# Altium schematic sheet TMS5701224 Interfaces.SchDoc: TMS5701224 R4F MCU Interfaces
size Tabloid; SheetNumber: 17; SheetTotal: 18
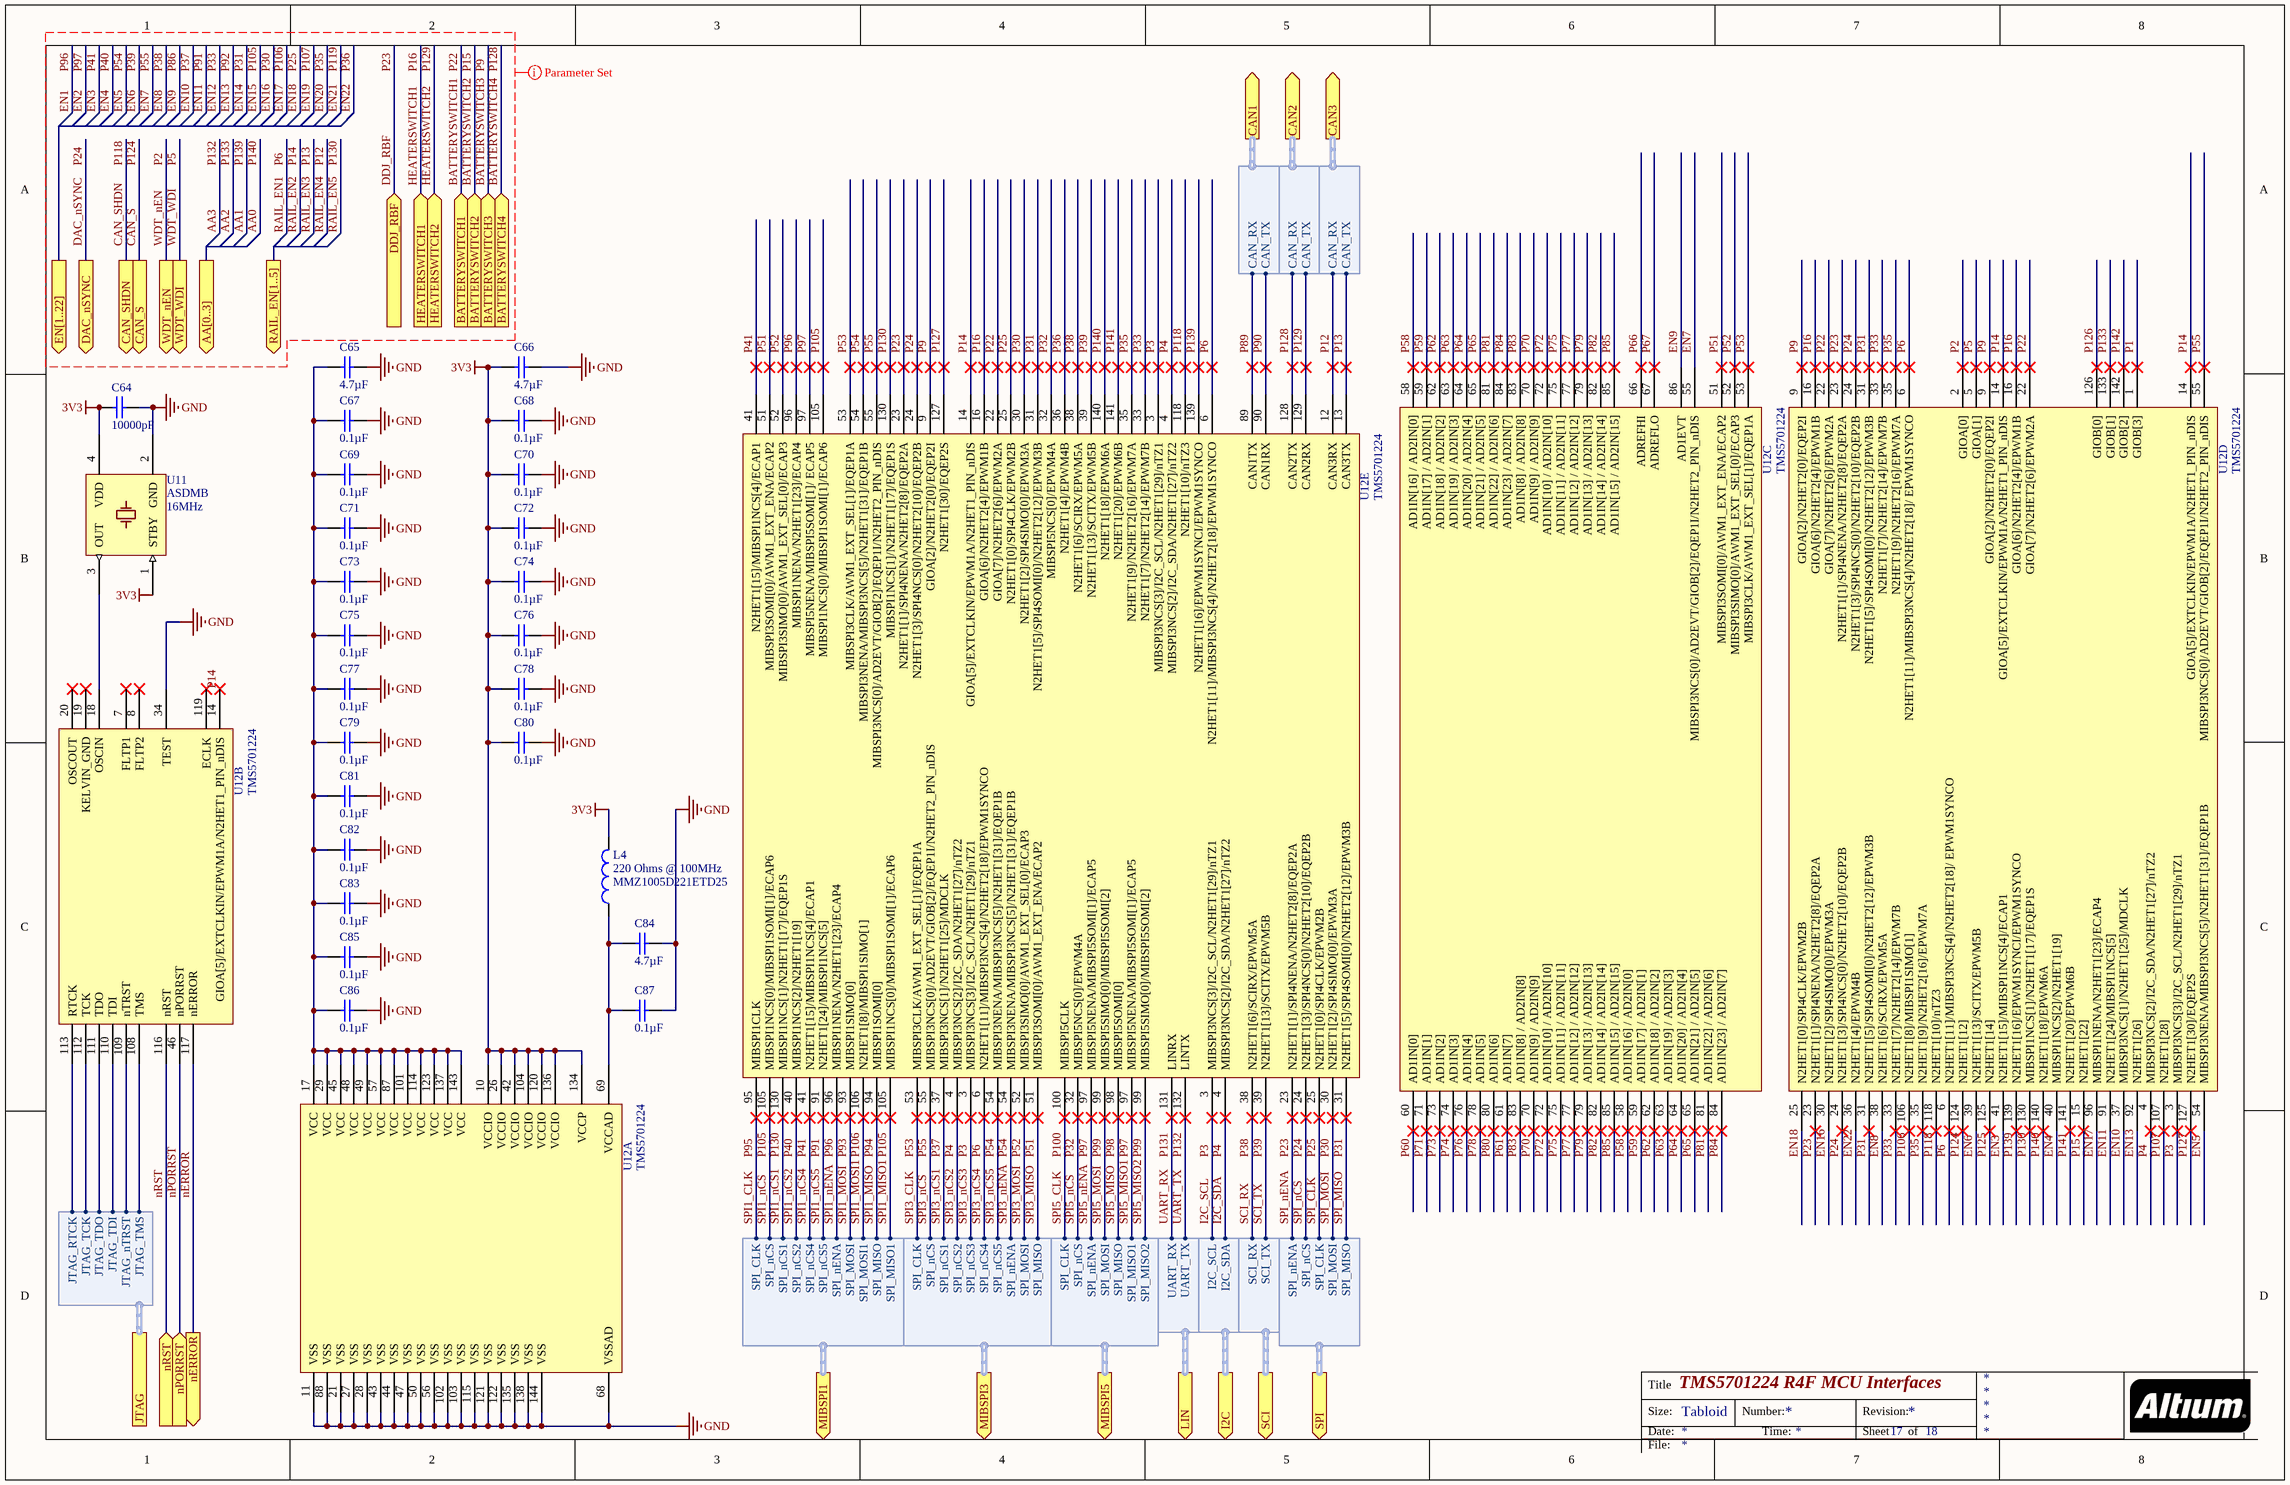
[diagram p0: TMS5701224 Interfaces.SchDoc]

## Parts
C64  value 10000pF  [TDK-CGA2B]  (hidden comment: Cap)
C65  value 4.7µF  [TDK-CGA4J]  (hidden comment: Cap)
C66  value 4.7µF  [TDK-CGA4J]  (hidden comment: Cap)
C67  value 0.1µF  [TDK-CGA2B]  (hidden comment: Cap)
C68  value 0.1µF  [TDK-CGA2B]  (hidden comment: Cap)
C69  value 0.1µF  [TDK-CGA2B]  (hidden comment: Cap)
C70  value 0.1µF  [TDK-CGA2B]  (hidden comment: Cap)
C71  value 0.1µF  [TDK-CGA2B]  (hidden comment: Cap)
C72  value 0.1µF  [TDK-CGA2B]  (hidden comment: Cap)
C73  value 0.1µF  [TDK-CGA2B]  (hidden comment: Cap)
C74  value 0.1µF  [TDK-CGA2B]  (hidden comment: Cap)
C75  value 0.1µF  [TDK-CGA2B]  (hidden comment: Cap)
C76  value 0.1µF  [TDK-CGA2B]  (hidden comment: Cap)
C77  value 0.1µF  [TDK-CGA2B]  (hidden comment: Cap)
C78  value 0.1µF  [TDK-CGA2B]  (hidden comment: Cap)
C79  value 0.1µF  [TDK-CGA2B]  (hidden comment: Cap)
C80  value 0.1µF  [TDK-CGA2B]  (hidden comment: Cap)
C81  value 0.1µF  [TDK-CGA2B]  (hidden comment: Cap)
C82  value 0.1µF  [TDK-CGA2B]  (hidden comment: Cap)
C83  value 0.1µF  [TDK-CGA2B]  (hidden comment: Cap)
C84  value 4.7µF  [TDK-CGA4J]  (hidden comment: Cap)
C85  value 0.1µF  [TDK-CGA2B]  (hidden comment: Cap)
C86  value 0.1µF  [TDK-CGA2B]  (hidden comment: Cap)
C87  value 0.1µF  [TDK-CGA2B]  (hidden comment: Cap)
L4  value 220 Ohms @ 100MHz  Manufacturer Part Number: MMZ1005D221ETD25  [TDK-MMZ1005]  (hidden comment: Inductor)
U11  ASDMB  value 16MHz  [ABR-ASDMB]
U12  TMS5701224  [TI-S-PQFP-G144]  (parts A,B,C,D,E of 5)

## Ports
AA[0..3] (out), BATTERYSWITCH1 (in), BATTERYSWITCH2 (in), BATTERYSWITCH3 (in), BATTERYSWITCH4 (in), CAN1 (out, harness TMS570_CAN1), CAN2 (out, harness TMS570_CAN2), CAN3 (out, harness TMS570_CAN3), CAN_S (out), CAN_SHDN (out), DAC_nSYNC (out), DDJ_RBF (in), EN[1..22] (out), HEATERSWITCH1 (in), HEATERSWITCH2 (in), I2C (out, harness TMS570_I2C), JTAG (harness TMS570_JTAG), LIN (out, harness TMS570_LIN), MIBSPI1 (out, harness TMS570_MIBSPI1), MIBSPI3 (out, harness TMS570_MIBSPI3), MIBSPI5 (out, harness TMS570_MIBSPI5), nERROR (out), nPORRST (in), nRST (in), RAIL_EN[1..5] (out), SCI (out, harness TMS570_SCI), SPI (out, harness TMS570_SPI), WDT_nEN (out), WDT_WDI (out)

## Harnesses
TMS570_MIBSPI1: SPI_CLK, SPI_nCS, SPI_nCS1, SPI_nCS2, SPI_nCS4, SPI_nCS5, SPI_nENA, SPI_MOSI, SPI_MOSI1, SPI_MISO, SPI_MISO1
TMS570_MIBSPI3: SPI_CLK, SPI_nCS, SPI_nCS1, SPI_nCS2, SPI_nCS3, SPI_nCS4, SPI_nCS5, SPI_nENA, SPI_MOSI, SPI_MISO
TMS570_MIBSPI5: SPI_CLK, SPI_nCS, SPI_nENA, SPI_MOSI, SPI_MISO, SPI_MISO1, SPI_MISO2
TMS570_LIN: UART_RX, UART_TX
TMS570_I2C: I2C_SCL, I2C_SDA
TMS570_SCI: SCI_RX, SCI_TX
TMS570_SPI: SPI_nENA, SPI_nCS, SPI_CLK, SPI_MOSI, SPI_MISO
TMS570_CAN2: CAN_RX, CAN_TX
TMS570_CAN3: CAN_RX, CAN_TX
TMS570_CAN1: CAN_RX, CAN_TX
TMS570_JTAG: JTAG_TMS, JTAG_TCK, JTAG_TDO, JTAG_TDI, JTAG_nTRST, JTAG_RTCK

## Nets
3V3: C64.2 C66.2 C68.2 C70.2 C72.2 C74.2 C76.2 C78.2 C80.2 L4.1 U11.1(STBY) U11.4(VDD) U12.10(VCCIO) U12.26(VCCIO) U12.42(VCCIO) U12.104(VCCIO) U12.120(VCCIO) U12.134(VCCP) U12.136(VCCIO)
GND: C64.1 C65.1 C66.1 C67.1 C68.1 C69.1 C70.1 C71.1 C72.1 C73.1 C74.1 C75.1 C76.1 C77.1 C78.1 C79.1 C80.1 C81.1 C82.1 C83.1 C84.1 C85.1 C86.1 C87.1 U11.2(GND) U12.11(VSS) U12.21(VSS) U12.27(VSS) U12.28(VSS) U12.34(TEST) U12.43(VSS) U12.44(VSS) U12.47(VSS) U12.50(VSS) U12.56(VSS) U12.68(VSSAD) U12.88(VSS) U12.102(VSS) U12.103(VSS) U12.115(VSS) U12.121(VSS) U12.122(VSS) U12.135(VSS) U12.138(VSS) U12.144(VSS)
AA0: U12.140(N2HET1[18]/EPWM6A)  [also labelled P140]
AA1: U12.139(N2HET1[16]/EPWM1SYNCI/EPWM1SYNCO)  [also labelled P139]
AA2: U12.133(GIOB[1])  [also labelled P133]
AA3: U12.132(LINTX) ; port LIN.UART_TX  [also labelled P132, UART_TX]
BATTERYSWITCH1: U12.22(GIOA[7]/N2HET2[6]/EPWM2A) ; port BATTERYSWITCH1  [also labelled P22]
BATTERYSWITCH2: U12.15(N2HET1[22]) ; port BATTERYSWITCH2  [also labelled P15]
BATTERYSWITCH3: U12.9(GIOA[2]/N2HET2[0]/EQEP2I) ; port BATTERYSWITCH3  [also labelled P9]
BATTERYSWITCH4: U12.128(CAN2TX) ; port BATTERYSWITCH4, port CAN2.CAN_RX  [also labelled P128]
CAN_S: U12.124(N2HET1[12]) ; port CAN_S  [also labelled P124]
CAN_SHDN: U12.118(N2HET1[10]/nTZ3) ; port CAN_SHDN  [also labelled P118]
DAC_nSYNC: U12.24(N2HET1[3]/SPI4NCS[0]/N2HET2[10]/EQEP2B) ; port DAC_nSYNC, port SPI.SPI_nCS  [also labelled P24, SPI_nCS]
DDJ_RBF: U12.23(N2HET1[1]/SPI4NENA/N2HET2[8]/EQEP2A) ; port DDJ_RBF, port SPI.SPI_nENA  [also labelled P23, SPI_nENA]
EN1: U12.96(MIBSPI1NENA/N2HET1[23]/ECAP4) ; port MIBSPI1.SPI_nENA  [also labelled P96, SPI1_nENA]
EN2: U12.97(MIBSPI5NENA/MIBSPI5SOMI[1]/_ECAP5) ; port MIBSPI5.SPI_nENA, port MIBSPI5.SPI_MISO1  [also labelled P97, SPI5_MISO1, SPI5_nENA]
EN3: U12.41(N2HET1[15]/MIBSPI1NCS[4]/ECAP1) ; port MIBSPI1.SPI_nCS4  [also labelled P41, SPI1_nCS4]
EN4: U12.40(MIBSPI1NCS[2]/N2HET1[19]) ; port MIBSPI1.SPI_nCS2  [also labelled P40, SPI1_nCS2]
EN5: U12.54(MIBSPI3NENA/MIBSPI3NCS[5]/N2HET1[31]/EQEP1B) ; port MIBSPI3.SPI_nCS5, port MIBSPI3.SPI_nENA  [also labelled P54, SPI3_nCS5, SPI3_nENA]
EN6: U12.39(N2HET1[13]/SCITX/EPWM5B) ; port SCI.SCI_TX  [also labelled P39, SCI_TX]
EN7: U12.55(MIBSPI3NCS[0]/AD2EVT/GIOB[2]/EQEP1I/N2HET2_PIN_nDIS) ; port MIBSPI3.SPI_nCS  [also labelled P55, SPI3_nCS]
EN8: U12.38(N2HET1[6]/SCIRX/EPWM5A) ; port SCI.SCI_RX  [also labelled P38, SCI_RX]
EN9: U12.86(AD1EVT)  [also labelled P86]
EN10: U12.37(MIBSPI3NCS[1]/N2HET1[25]/MDCLK) ; port MIBSPI3.SPI_nCS1  [also labelled P37, SPI3_nCS1]
EN11: U12.91(N2HET1[24]/MIBSPI1NCS[5]) ; port MIBSPI1.SPI_nCS5  [also labelled P91, SPI1_nCS5]
EN12: U12.33(N2HET1[7]/N2HET2[14]/EPWM7B)  [also labelled P33]
EN13: U12.92(N2HET1[26])  [also labelled P92]
EN14: U12.31(N2HET1[5]/SPI4SOMI[0]/N2HET2[12]/EPWM3B) ; port SPI.SPI_MISO  [also labelled P31, SPI_MISO]
EN15: U12.105(MIBSPI1NCS[0]/MIBSPI1SOMI[1]/ECAP6) ; port MIBSPI1.SPI_nCS, port MIBSPI1.SPI_MISO1  [also labelled P105, SPI1_MISO1, SPI1_nCS]
EN16: U12.30(N2HET1[2]/SPI4SIMO[0]/EPWM3A) ; port SPI.SPI_MOSI  [also labelled P30, SPI_MOSI]
EN17: U12.96(MIBSPI1NENA/N2HET1[23]/ECAP4) U12.106(N2HET1[8]/MIBSPI1SIMO[1]) ; port MIBSPI1.SPI_MOSI1  [also labelled P106, SPI1_MOSI1]
EN18: U12.25(N2HET1[0]/SPI4CLK/EPWM2B) ; port SPI.SPI_CLK  [also labelled P25, SPI_CLK]
EN19: U12.107(N2HET1[28])  [also labelled P107]
EN20: U12.35(N2HET1[9]/N2HET2[16]/EPWM7A)  [also labelled P35]
EN22: U12.36(N2HET1[4]/EPWM4B)  [also labelled P36]
HEATERSWITCH1: U12.16(GIOA[6]/N2HET2[4]/EPWM1B) ; port HEATERSWITCH1  [also labelled P16]
HEATERSWITCH2: U12.129(CAN2RX) ; port HEATERSWITCH2, port CAN2.CAN_TX  [also labelled P129]
I2C_SCL: U12.3(MIBSPI3NCS[3]/I2C_SCL/N2HET1[29]/nTZ1) ; port MIBSPI3.SPI_nCS3, port I2C.I2C_SCL  [also labelled P3, SPI3_nCS3]
I2C_SDA: U12.4(MIBSPI3NCS[2]/I2C_SDA/N2HET1[27]/nTZ2) ; port MIBSPI3.SPI_nCS2, port I2C.I2C_SDA  [also labelled P4, SPI3_nCS2]
nERROR: U12.117(nERROR) ; port nERROR
nPORRST: U12.46(nPORRST) ; port nPORRST
nRST: U12.116(nRST) ; port nRST
P1: U12.1(GIOB[3])
P2: U12.2(GIOA[0]) ; port WDT_nEN  [also labelled WDT_nEN]
P5: U12.5(GIOA[1]) ; port WDT_WDI  [also labelled WDT_WDI]
P6: U12.6(N2HET1[11]/MIBSPI3NCS[4]/N2HET2[18]/EPWM1SYNCO) ; port MIBSPI3.SPI_nCS4  [also labelled RAIL_EN1, SPI3_nCS4]
P12: U12.12(CAN3RX) ; port CAN3.CAN_RX  [also labelled RAIL_EN4]
P13: U12.13(CAN3TX) ; port CAN3.CAN_TX  [also labelled RAIL_EN3]
P14: U12.14(GIOA[5]/EXTCLKIN/EPWM1A/N2HET1_PIN_nDIS)  [also labelled RAIL_EN2]
P32: U12.32(MIBSPI5NCS[0]/EPWM4A) ; port MIBSPI5.SPI_nCS  [also labelled SPI5_nCS]
P51: U12.51(MIBSPI3SOMI[0]/AWM1_EXT_ENA/ECAP2) ; port MIBSPI3.SPI_MISO  [also labelled SPI3_MISO]
P52: U12.52(MIBSPI3SIMO[0]/AWM1_EXT_SEL[0]/ECAP3) ; port MIBSPI3.SPI_MOSI  [also labelled SPI3_MOSI]
P53: U12.53(MIBSPI3CLK/AWM1_EXT_SEL[1]/EQEP1A) ; port MIBSPI3.SPI_CLK  [also labelled SPI3_CLK]
P58: U12.58(AD1IN[16]_/_AD2IN[0])
P59: U12.59(AD1IN[17]_/_AD2IN[1])
P60: U12.60(AD1IN[0])
P61: U12.61(AD1IN[7])
P62: U12.62(AD1IN[18]_/_AD2IN[2])
P63: U12.63(AD1IN[19]_/_AD2IN[3])
P64: U12.64(AD1IN[20]_/_AD2IN[4])
P65: U12.65(AD1IN[21]_/_AD2IN[5])
P66: U12.66(ADREFHI)
P67: U12.67(ADREFLO)
P70: U12.70(AD1IN[9]_/_AD2IN[9])
P71: U12.71(AD1IN[1])
P72: U12.72(AD1IN[10]_/_AD2IN[10])
P73: U12.73(AD1IN[2])
P74: U12.74(AD1IN[3])
P75: U12.75(AD1IN[11]_/_AD2IN[11])
P76: U12.76(AD1IN[4])
P77: U12.77(AD1IN[12]_/_AD2IN[12])
P78: U12.78(AD1IN[5])
P79: U12.79(AD1IN[13]_/_AD2IN[13])
P80: U12.80(AD1IN[6])
P81: U12.81(AD1IN[22]_/_AD2IN[6])
P82: U12.82(AD1IN[14]_/_AD2IN[14])
P83: U12.83(AD1IN[8]_/_AD2IN[8])
P84: U12.84(AD1IN[23]_/_AD2IN[7])
P85: U12.85(AD1IN[15]_/_AD2IN[15])
P89: U12.89(CAN1TX) ; port CAN1.CAN_RX
P90: U12.90(CAN1RX) ; port CAN1.CAN_TX
P93: U12.93(MIBSPI1SIMO[0]) ; port MIBSPI1.SPI_MOSI  [also labelled SPI1_MOSI]
P94: U12.94(MIBSPI1SOMI[0]) ; port MIBSPI1.SPI_MISO  [also labelled SPI1_MISO]
P95: U12.95(MIBSPI1CLK) ; port MIBSPI1.SPI_CLK  [also labelled SPI1_CLK]
P98: U12.98(MIBSPI5SOMI[0]) ; port MIBSPI5.SPI_MISO  [also labelled SPI5_MISO]
P99: U12.99(MIBSPI5SIMO[0]/MIBSPI5SOMI[2]) ; port MIBSPI5.SPI_MOSI, port MIBSPI5.SPI_MISO2  [also labelled SPI5_MISO2, SPI5_MOSI]
P100: U12.100(MIBSPI5CLK) ; port MIBSPI5.SPI_CLK  [also labelled SPI5_CLK]
P125: U12.125(N2HET1[14])
P126: U12.126(GIOB[0])
P127: U12.127(N2HET1[30]/EQEP2S)
P130: U12.130(MIBSPI1NCS[1]/N2HET1[17]/EQEP1S) ; port MIBSPI1.SPI_nCS1  [also labelled RAIL_EN5, SPI1_nCS1]
P131: U12.131(LINRX) ; port LIN.UART_RX  [also labelled UART_RX]
P141: U12.141(N2HET1[20]/EPWM6B)
P142: U12.142(GIOB[2])
NetC65_2: C65.2 C67.2 C69.2 C71.2 C73.2 C75.2 C77.2 C79.2 C81.2 C82.2 C83.2 C85.2 C86.2 U12.17(VCC) U12.29(VCC) U12.45(VCC) U12.48(VCC) U12.49(VCC) U12.57(VCC) U12.87(VCC) U12.101(VCC) U12.114(VCC) U12.123(VCC) U12.137(VCC) U12.143(VCC)
NetC84_2: C84.2 C87.2 L4.2 U12.69(VCCAD)
NetU11_3: U11.3(OUT) U12.18(OSCIN)
NetU12_108: U12.108(TMS) ; port JTAG.JTAG_TMS
NetU12_109: U12.109(nTRST) ; port JTAG.JTAG_nTRST
NetU12_110: U12.110(TDI) ; port JTAG.JTAG_TDI
NetU12_111: U12.111(TDO) ; port JTAG.JTAG_TDO
NetU12_112: U12.112(TCK) ; port JTAG.JTAG_TCK
NetU12_113: U12.113(RTCK) ; port JTAG.JTAG_RTCK

Not connected (* = marked no-connect by the designer): U12 7(FLTP1)* 8(FLTP2)* 19(KELVIN_GND)* 20(OSCOUT)* 119(ECLK)*

## Layout directives
net class GPIO: AA0, AA1, AA2, AA3, BATTERYSWITCH1, BATTERYSWITCH2, BATTERYSWITCH3, BATTERYSWITCH4, CAN_S, CAN_SHDN, DAC_nSYNC, DDJ_RBF, EN1, EN2, EN3, EN4, EN5, EN6, EN7, EN8, EN9, EN10, EN11, EN12, EN13, EN14, EN15, EN16, EN17, EN18, EN19, EN20, EN21, EN22, HEATERSWITCH1, HEATERSWITCH2, P2, P5, P6, P9, P12, P13, P14, P15, P16, P22, P23, P24, P25, P30, P31, P33, P35, P36, P37, P38, P39, P40, P41, P54, P55, P86, P91, P92, P96, P97, P105, P106, P107, P118, P119, P124, P128, P129, P130, P132, P133, P139, P140, RAIL_EN1, RAIL_EN2, RAIL_EN3, RAIL_EN4, RAIL_EN5, WDT_nEN, WDT_WDI

## Notes on the sheet
- Title
- Size:
- Date:
- Tabloid
- Number:
- Time:
- Revision:
- Sheet
- of
- File:

## Library data of the parts
C64 = PC-TDK-01877: CAP CER 10000PF 50V X8R 0402; Manufacturer Part Number: CGA2B3X8R1H103K050BB; Index: 1877; Designator: C?; Tolerance: ±10%; Published: 2016-03-16; LatestRevisionDate: 2016-03-16; LatestRevisionNote: ...; PackageReference: 0402 (1005 Metric); Publisher: AlbertaSat; PackageDescription: Radial Cap, Thru-Hole; 2 Leads; 0.3 in Pin Spacing; Part Number: PC-TDK-01877; Supplier Part Number 1: 445-12303-1-ND; Supplier 1: Digi-key; Supplier Link: http://www.digikey.ca/product-search/en?keywords=445-12303-1-ND; Voltage - Rated: 50V; Temperature Coefficient: X8R; Applications: Automotive
C65 C66 C84 = PC-TDK-02831: CAP CER 4.7UF 25V X7R 0805; Manufacturer Part Number: CGA4J1X7R1E475M125AC; Index: 2831; Designator: C?; Tolerance: ±20%; Published: 2016-03-16; LatestRevisionDate: 2016-03-16; LatestRevisionNote: ...; PackageReference: 0805 (2012 Metric); Publisher: AlbertaSat; PackageDescription: Radial Cap, Thru-Hole; 2 Leads; 0.3 in Pin Spacing; Part Number: PC-TDK-02831; Supplier Part Number 1: 445-12761-1-ND; Supplier 1: Digi-key; Supplier Link: http://www.digikey.ca/product-search/en?keywords=445-12761-1-ND; Voltage - Rated: 25V; Temperature Coefficient: X7R; Applications: Automotive
C67-C83 C85-C87 = PC-TDK-02262: CAP CER 0.1UF 50V X7R 0402; Manufacturer Part Number: CGA2B3X7R1H104M050BB; Index: 2262; Designator: C?; Tolerance: ±20%; Published: 2016-03-16; LatestRevisionDate: 2016-03-16; LatestRevisionNote: ...; PackageReference: 0402 (1005 Metric); Publisher: AlbertaSat; PackageDescription: Radial Cap, Thru-Hole; 2 Leads; 0.3 in Pin Spacing; Part Number: PC-TDK-02262; Supplier Part Number 1: 445-12271-1-ND; Supplier 1: Digi-key; Supplier Link: http://www.digikey.ca/product-search/en?keywords=445-12271-1-ND; Voltage - Rated: 50V; Temperature Coefficient: X7R; Applications: Automotive
L4 = PL-TDK-02958: 1005; Index: 2958; Designator: L?; Current - Rated: 250mA; Published: 2018-07-17; LatestRevisionDate: 2018-07-17; LatestRevisionNote: ...; PackageReference: 0402 (1005 Metric); Publisher: AlbertaSat; PackageDescription: Chip Inductor, 2-Leads, Body 1.00x0.50mm, IPC Low Density; Code_JEITA: 0402; Code_IEC: 1005; Part Number: PL-TDK-02958; Supplier Part Number 1: 445-172789-1-ND; Supplier 1: Digi-key; Supplier Part Number 2: 810-MMZ1005D221ETD25; Supplier 2: Mouser; Supplier Link: 0402; Applications: Automotive
U11 = PU-ABR-00014: OSC MEMS 16.000MHZ CMOS SMD; Manufacturer Part Number: ASDMB-16.000MHZ-XY-T; Index: 14; Designator: U?; Tolerance: ±10ppm; Part Number: PU-ABR-00014; Supplier Part Number 1: 535-11457-1-ND; Supplier 1: Digi-key; Supplier Part Number 2: 815-ASDMB-16-XY-T; Supplier 2: Mouser; Publisher: AlbertaSat; Published: 2017-10-24; LatestRevisionDate: 2017-10-24; LatestRevisionNote: ...; PackageReference: 4-SMD, No Lead; PackageDescription: DFN, 4-Leads, Body 2.00x2.50mm, Pitch 1.65mm, IPC Low Density; Supplier Link: http://www.digikey.ca/product-search/en?keywords=535-11457-1-ND
U12 = 59: IC MCU 32BIT 1.25MB FLASH 144QFP; Part Number: 59; Designator: U?; Core Processor: Arm-Cortex - R4F; Core Size: 32-Bit; Speed: 160MHz; Program Memory Size: 1280KB (1280K x 8); RAM Size: 192K (192K X 8); Supplier Part Number 2: 595-MS5701224CPGEQQ1; Supplier 2: Mouser; Manufacturer Part Number: TMS5701224CPGEQQ1; Supplier Part Number 1: 296-47200-ND; Supplier 1: Digi-Key; Supplier Link: #https://www.digikey.ca/product-detail/en/texas-instruments/TMS5701224CPGEQQ1/296-47200-ND/5414218#; PackageReference: 144-LQFP; Operating Temperature: -40°C ~ 125°C (TJ)